# Altium schematic sheet UART_TagConnect.SchDoc: Tag-Connect DEBUG Port
size A4; DocumentNumber: 8; SheetNumber: 8; SheetTotal: 51
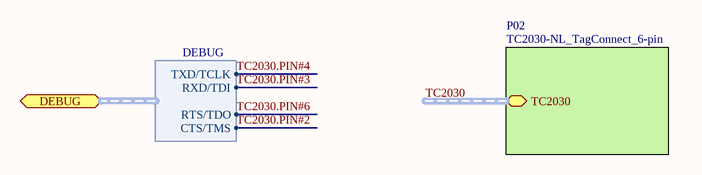
[diagram p0: UART_TagConnect.SchDoc]

## Sub-sheets
P02 = TC2030-NL_TagConnect_6-pin: TC2030 (harness TC2030)

## Ports
DEBUG (harness DEBUG)

## Harnesses
DEBUG: TXD/TCLK, RXD/TDI, RTS/TDO, CTS/TMS

## Nets
TC2030.PIN#2: port DEBUG.CTS/TMS
TC2030.PIN#3: port DEBUG.RXD/TDI
TC2030.PIN#4: port DEBUG.TXD/TCLK
TC2030.PIN#6: port DEBUG.RTS/TDO

## Buses and harness runs
harness TC2030 = sheet P02/TC2030

## Notes on the sheet
- Title
- Size:
- Date:
- A4
- Number:
- Time:
- Revision:
- Sheet
- of
- File: